# Altium project UltiController.PrjPcb
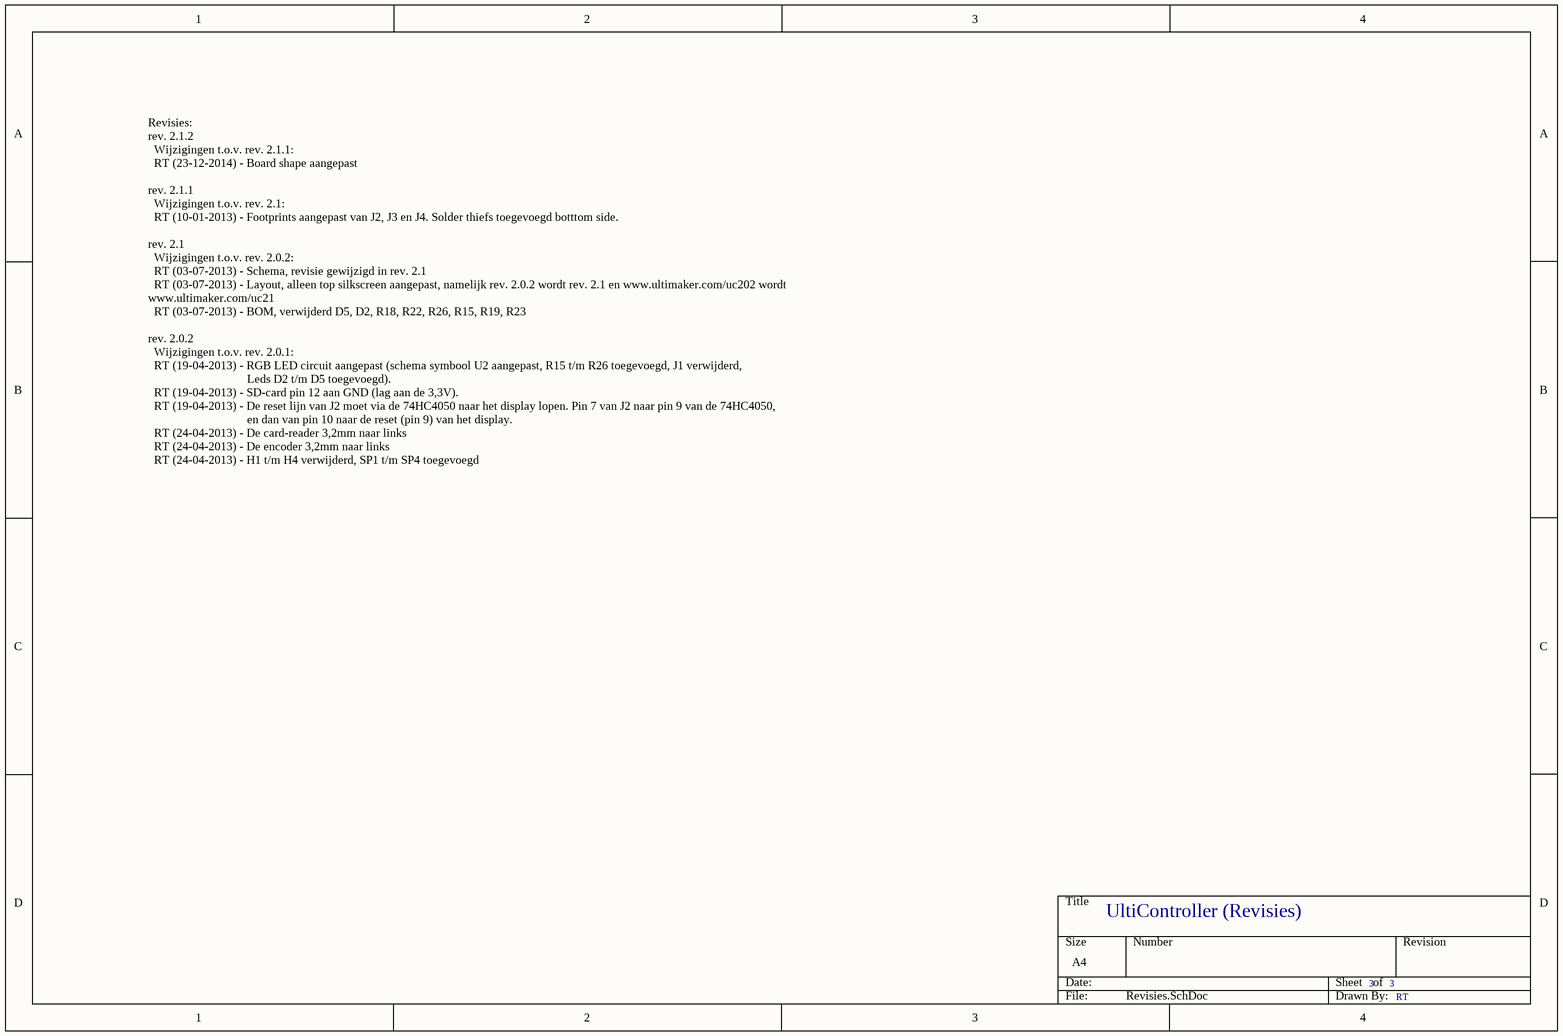
[diagram p0: Revisies.SchDoc]
3 sheets, 131 parts. Net scope: flat (ports and power ports of the same name join across sheets).
Board file: UltiController.PcbDoc
Sheets:
  Revisies.SchDoc
  Sheet1.SchDoc
  Sheet2.SchDoc

## Sheet Revisies.SchDoc
size A4; CompanyName: Ultimaker; Revision: rev. 2.0.2

### Notes on the sheet
- Revisies:
  rev. 2.1.2
  Wijzigingen t.o.v. rev. 2.1.1:
  RT (23-12-2014) - Board shape aangepast
  rev. 2.1.1
  Wijzigingen t.o.v. rev. 2.1:
  RT (10-01-2013) - Footprints aangepast van J2, J3 en J4. Solder thiefs toegevoegd botttom side.
  rev. 2.1
  Wijzigingen t.o.v. rev. 2.0.2:
  RT (03-07-2013) - Schema, revisie gewijzigd in rev. 2.1
  RT (03-07-2013) - Layout, alleen top silkscreen aangepast, namelijk rev. 2.0.2 wordt rev. 2.1 en www.ultimaker.com/uc202 wordt                                      www.ultimaker.com/uc21
  RT (03-07-2013) - BOM, verwijderd D5, D2, R18, R22, R26, R15, R19, R23
  rev. 2.0.2
  Wijzigingen t.o.v. rev. 2.0.1:
  RT (19-04-2013) - RGB LED circuit aangepast (schema symbool U2 aangepast, R15 t/m R26 toegevoegd, J1 verwijderd,
  Leds D2 t/m D5 toegevoegd).
  RT (19-04-2013) - SD-card pin 12 aan GND (lag aan de 3,3V).
  RT (19-04-2013) - De reset lijn van J2 moet via de 74HC4050 naar het display lopen. Pin 7 van J2 naar pin 9 van de 74HC4050,
  en dan van pin 10 naar de reset (pin 9) van het display.
  RT (24-04-2013) - De card-reader 3,2mm naar links
  RT (24-04-2013) - De encoder 3,2mm naar links
  RT (24-04-2013) - H1 t/m H4 verwijderd, SP1 t/m SP4 toegevoegd
- UltiController (Revisies)
- 3
- RT

## Sheet Sheet1.SchDoc
size A4; CompanyName: Ultimaker; Revision: rev. 2.1.2
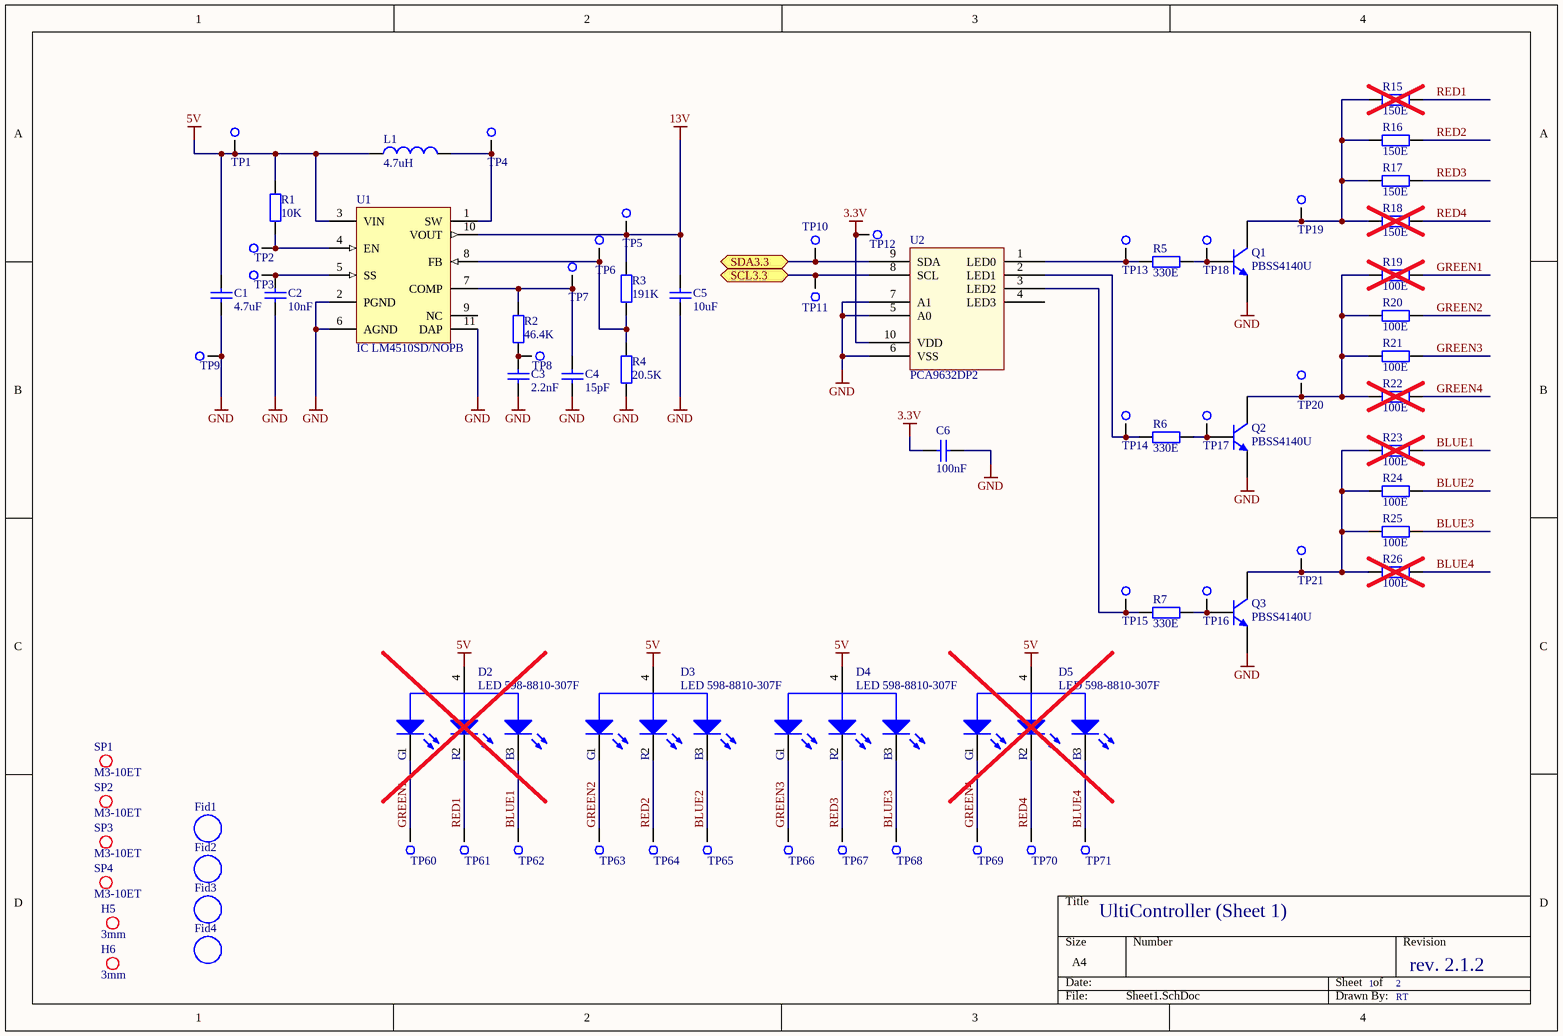
[diagram p1: Sheet1.SchDoc]

### Parts
C1  4.7uF  [C1206 (3216)]
C2  10nF  [C0805 (2012)]
C3  2.2nF  [C0805 (2012)]
C4  15pF  [C0805 (2012)]
C5  10uF  [C1206 (3216)]
C6  100nF  [C0805 (2012)]
D2  LED 598-8810-307F  [LED SMD  598-8810-307F]  (no BOM)
D3  LED 598-8810-307F  [LED SMD  598-8810-307F]
D4  LED 598-8810-307F  [LED SMD  598-8810-307F]
D5  LED 598-8810-307F  [LED SMD  598-8810-307F]  (no BOM)
Fid1  Fiducial  [Fiducial 1,5mm]  (value not drawn)  (no BOM)
Fid2  Fiducial  [Fiducial 1,5mm]  (value not drawn)  (no BOM)
Fid3  Fiducial  [Fiducial 1,5mm]  (value not drawn)  (no BOM)
Fid4  Fiducial  [Fiducial 1,5mm]  (value not drawn)  (no BOM)
H5  3mm  [Mounting Hole 3mm PTH]  (no BOM)
H6  3mm  [Mounting Hole 3mm PTH]  (no BOM)
L1  4.7uH  [Inductor MCSDC0604]
Q1  PBSS4140U  [IC SOT323]
Q2  PBSS4140U  [IC SOT323]
Q3  PBSS4140U  [IC SOT323]
R1  10K  [R0805 (2012)]
R2  46.4K  [R0805 (2012)]
R3  191K  [R0805 (2012)]
R4  20.5K  [R0805 (2012)]
R5  330E  [R0805 (2012)]
R6  330E  [R0805 (2012)]
R7  330E  [R0805 (2012)]
R15  150E  [R0805 (2012)]  (no BOM)
R16  150E  [R0805 (2012)]
R17  150E  [R0805 (2012)]
R18  150E  [R0805 (2012)]  (no BOM)
R19  100E  [R0805 (2012)]  (no BOM)
R20  100E  [R0805 (2012)]
R21  100E  [R0805 (2012)]
R22  100E  [R0805 (2012)]  (no BOM)
R23  100E  [R0805 (2012)]  (no BOM)
R24  100E  [R0805 (2012)]
R25  100E  [R0805 (2012)]
R26  100E  [R0805 (2012)]  (no BOM)
SP1  M3-10ET  [Spacer M3-10ET]
SP2  M3-10ET  [Spacer M3-10ET]
SP3  M3-10ET  [Spacer M3-10ET]
SP4  M3-10ET  [Spacer M3-10ET]
TP1  2mm  [TESTPOINT 2mm]  (value not drawn)  (no BOM)
TP2  2mm  [TESTPOINT 2mm]  (value not drawn)  (no BOM)
TP3  2mm  [TESTPOINT 2mm]  (value not drawn)  (no BOM)
TP4  2mm  [TESTPOINT 2mm]  (value not drawn)  (no BOM)
TP5  2mm  [TESTPOINT 2mm]  (value not drawn)  (no BOM)
TP6  2mm  [TESTPOINT 2mm]  (value not drawn)  (no BOM)
TP7  2mm  [TESTPOINT 2mm]  (value not drawn)  (no BOM)
TP8  2mm  [TESTPOINT 2mm]  (value not drawn)  (no BOM)
TP9  2mm  [TESTPOINT 2mm]  (value not drawn)  (no BOM)
TP10  2mm  [TESTPOINT 2mm]  (value not drawn)  (no BOM)
TP11  2mm  [TESTPOINT 2mm]  (value not drawn)  (no BOM)
TP12  2mm  [TESTPOINT 2mm]  (value not drawn)  (no BOM)
TP13  2mm  [TESTPOINT 2mm]  (value not drawn)  (no BOM)
TP14  2mm  [TESTPOINT 2mm]  (value not drawn)  (no BOM)
TP15  2mm  [TESTPOINT 2mm]  (value not drawn)  (no BOM)
TP16  2mm  [TESTPOINT 2mm]  (value not drawn)  (no BOM)
TP17  2mm  [TESTPOINT 2mm]  (value not drawn)  (no BOM)
TP18  2mm  [TESTPOINT 2mm]  (value not drawn)  (no BOM)
TP19  2mm  [TESTPOINT 2mm]  (value not drawn)  (no BOM)
TP20  2mm  [TESTPOINT 2mm]  (value not drawn)  (no BOM)
TP21  2mm  [TESTPOINT 2mm]  (value not drawn)  (no BOM)
TP60  2mm  [TESTPOINT 2mm]  (value not drawn)  (no BOM)
TP61  2mm  [TESTPOINT 2mm]  (value not drawn)  (no BOM)
TP62  2mm  [TESTPOINT 2mm]  (value not drawn)  (no BOM)
TP63  2mm  [TESTPOINT 2mm]  (value not drawn)  (no BOM)
TP64  2mm  [TESTPOINT 2mm]  (value not drawn)  (no BOM)
TP65  2mm  [TESTPOINT 2mm]  (value not drawn)  (no BOM)
TP66  2mm  [TESTPOINT 2mm]  (value not drawn)  (no BOM)
TP67  2mm  [TESTPOINT 2mm]  (value not drawn)  (no BOM)
TP68  2mm  [TESTPOINT 2mm]  (value not drawn)  (no BOM)
TP69  2mm  [TESTPOINT 2mm]  (value not drawn)  (no BOM)
TP70  2mm  [TESTPOINT 2mm]  (value not drawn)  (no BOM)
TP71  2mm  [TESTPOINT 2mm]  (value not drawn)  (no BOM)
U1  IC LM4510SD/NOPB  [IC SDA10A]
U2  PCA9632DP2  [IC TSSOP-10]

### Ports
SCL3.3 (bidir), SDA3.3 (bidir)

### Nets
3.3V: C6.1 TP12.1 U2.10(VDD)
5V: C1.2 D2.4 D3.4 D4.4 D5.4 L1.1 R1.2 TP1.1 U1.3(VIN)
13V: C5.2 R3.2 TP5.1 U1.10(VOUT)
GND: C1.1 C2.1 C3.1 C4.1 C5.1 C6.2 Q1.2(E) Q2.2(E) Q3.2(E) R4.1 TP9.1 U1.2(PGND) U1.6(AGND) U1.11(DAP) U2.5(A0) U2.6(VSS) U2.7(A1)
BLUE1: D2.3 R23.2 TP62.1
BLUE2: D3.3 R24.2 TP65.1
BLUE3: D4.3 R25.2 TP68.1
BLUE4: D5.3 R26.2 TP71.1
GREEN1: D2.1 R19.2 TP60.1
GREEN2: D3.1 R20.2 TP63.1
GREEN3: D4.1 R21.2 TP66.1
GREEN4: D5.1 R22.2 TP69.1
RED1: D2.2 R15.2 TP61.1
RED2: D3.2 R16.2 TP64.1
RED3: D4.2 R17.2 TP67.1
RED4: D5.2 R18.2 TP70.1
NetC2_2: C2.2 TP3.1 U1.5(SS)
NetC3_2: C3.2 R2.1 TP8.1
NetC4_2: C4.2 R2.2 TP7.1 U1.7(COMP)
NetJ6_13: TP11.1 U2.8(SCL) ; port SCL3.3
NetJ6_14: TP10.1 U2.9(SDA) ; port SDA3.3
NetL1_2: L1.2 TP4.1 U1.1(SW)
NetQ1_1: Q1.1(B) R5.2 TP18.1
NetQ1_3: Q1.3(C) R15.1 R16.1 R17.1 R18.1 TP19.1
NetQ2_1: Q2.1(B) R6.2 TP17.1
NetQ2_3: Q2.3(C) R19.1 R20.1 R21.1 R22.1 TP20.1
NetQ3_1: Q3.1(B) R7.2 TP16.1
NetQ3_3: Q3.3(C) R23.1 R24.1 R25.1 R26.1 TP21.1
NetR1_1: R1.1 TP2.1 U1.4(EN)
NetR3_1: R3.1 R4.2 TP6.1 U1.8(FB)
NetR5_1: R5.1 TP13.1 U2.1(LED0)
NetR6_1: R6.1 TP14.1 U2.2(LED1)
NetR7_1: R7.1 TP15.1 U2.3(LED2)

Not connected (* = marked no-connect by the designer): U1 9(NC); U2 4(LED3)

### Notes on the sheet
- UltiController (Sheet 1)
- 1
- 2
- rev. 2.1.2
- RT
- (in symbol LED 598-8810-307F) G; R; B

### Library data of the parts
C1 = Cap 4.7uF X7R 1206: Cap 4.7uF 1206 X7R 10% 25V; Mfg: TDK; Mfg code: C3216X7R1E475K160AC; Faber ItemCode: -; Max soldering temp: -; Remarks: -; Supplier: Farnell; Supplier code: 1907356; Value: 4.7uF; SMD: Yes
C2 = Cap 10nF X7R 0805: Cap 10nF X7R 0805 10% 100V; Mfg: AVX; Mfg code: 08051C103K4Z2A; Faber ItemCode: -; Max soldering temp: -; Remarks: -; Supplier: Farnell; Supplier code: 1833850; SMD: Yes; Value: 10nF
C3 = Cap 2.2nF X7R 0805: Cap 2.2nF X7R 0805 10% 100V; Mfg: KEMET; Mfg code: C0805F222K1RACAUTO; Faber ItemCode: -; Max soldering temp: -; Remarks: -; Supplier: Farnell; Supplier code: 1869056; Value: 2.2nF; SMD: Yes
C4 = Cap 15pF NPO 0805: Cap 15pF NPO 0805 5% 100V; Mfg: AVX; Mfg code: 08051A150JAT2A; Faber ItemCode: -; Max soldering temp: -; Remarks: -; Supplier: Farnell; Supplier code: 1658873; Value: 15pF; SMD: Yes
C5 = Cap 10uF X7R 1206: Cap 10uF 1206 X7R 10% 25V; Mfg: KEMET; Mfg code: C1206C106K3RAC TU; Faber ItemCode: -; Max soldering temp: -; Remarks: -; Supplier: Farnell; Supplier code: 2118134; Value: 10uF; SMD: Yes
C6 = Cap 100nF X7R 0805: Cap 100nF X7R 0805 10% 100V; Mfg: AVX; Mfg code: 08051C104K4T2A; Faber ItemCode: -; Max soldering temp: -; Remarks: -; Supplier: Farnell; Supplier code: 1833888; Value: 100nF; SMD: Yes
D2-D5 = LED 598-8810-307F: LED MULTICOLOR RED/GRN/BLUE 1208; Mfg: DIALIGHT; Bestel grote: 1; Prijs: 2.26; Mfg code: 598-8810-307F; Faber itemcode: -; Supplier: Farnell; Supplier code: 1850760; Remarks: -; Value: -; Max soldering temp: -; SMD: Yes; Faber Artikelomschrijving: -
Fid1-Fid4 = Fiducial: Remarks: Not a component; Faber ItemCode: -; Mfg: -; Mfg code: -; Value: -; Supplier: -; Supplier code: -; Max soldering temp: -
H5 H6 = Mounting Hole 3mm PTH: Remarks: Not a component; Faber ItemCode: -; Mfg: -; Mfg code: -; Value: -; Supplier: -; Supplier code: -; Max soldering temp: -
L1 = Inductor 4.7uH SMD: Mfg: MULTICOMP; Mfg code: MCSDC0604-4R7MU; Faber ItemCode: -; Max soldering temp: -; Remarks: -; SMD: Yes; Supplier: Farnell; Supplier code: 1864164RL; Value: 4.7uH
Q1-Q3 = NPN PBSS4140U: NPN PBSS4140U SOT-323 1A; Mfg: NXP; Faber ItemCode: -; Max soldering temp: -; Mfg code: PBSS4140U; Remarks: -; Supplier: Farnell; Supplier code: 8736197; Value: -; SMD: Yes
R1 = Res 10K 0805: Res 10K 0805 1% 100mW; Mfg: MULTICOMP; Mfg code: MC 0.1W 0805 1% 10K; Faber ItemCode: -; Max soldering temp: -; Remarks: -; Supplier: Farnell; Supplier code: 9332391; Value: 10K; SMD: Yes
R2 = Res 46.4K 0805: Res 46.4K 0805 1% 100mW; Mfg: MULTICOMP; Mfg code: MC0.1W08051%46K4; Faber ItemCode: -; Max soldering temp: -; Remarks: -; Supplier: Farnell; Supplier code: 2141881RL; Value: 46.4K; SMD: Yes
R3 = Res 191K 0805: Res 191K 0805 1% 125mW; Mfg: VISHAY DRALORIC; Mfg code: CRCW0805191KFKEA; Faber ItemCode: -; Max soldering temp: -; Remarks: -; Supplier: Farnell; Supplier code: 2139049; Value: 191K; SMD: Yes
R4 = Res 20.5K 0805: Res 20.5K 0805 1% 100mW; Mfg: MULTICOMP; Mfg code: MC0.1W08051%20K5; Faber ItemCode: -; Max soldering temp: -; Remarks: -; Supplier: Farnell; Supplier code: 2141862RL; Value: 20.5K; SMD: Yes
R5-R7 = Res 330E 0805: Res 330E 0805 1% 100mW; Mfg: MULTICOMP; Mfg code: MC 0.1W 0805 1% 330R; Faber ItemCode: -; Max soldering temp: -; Remarks: -; Supplier: Farnell; Supplier code: 9333037; Value: 330E; SMD: Yes
R15-R18 = Res 150E 0805: Res 150E 0805 1% 125mW; Faber ItemCode: 31224600; Mfg: YAGEO; Mfg code: 2322 734 61501; Faber Artikelomschrijving: RES 150E 1% 0,125W 0805; Bestel grote: 5000; Prijs: 0,0012; Max soldering temp: -; Remarks: -; Supplier: AVNET Abacus; Supplier code: 2322 734 61501; Value: 150E; SMD: Yes
R19-R26 = Res 100E 0805: Res 100E 0805 1% 125mW; Faber ItemCode: 31560100; Mfg: YAGEO; Mfg code: WRC31022/ RC0805FR-07100RL; Faber Artikelomschrijving: RES 100E 1% 0,125W 0805; Bestel grote: 5000; Prijs: 0,0009; Max soldering temp: -; Remarks: -; Supplier: Rutronik; Supplier code: WRC31022/ RC0805FR-07100RL; Value: 100E; SMD: Yes
SP1-SP4 = Spacer M3-10ET: Spacer SMTSO-M3-10ET; Faber ItemCode: 36462900; Mfg: PEM; Faber Artikelomschrijving: MOER-SMD SMTSO-M3-10ET  PEM; Bestel grote: 300; Prijs: 0.4311; Mfg code: SMTSO-M3-10ET; Value: -; Remarks: -; Supplier: Onkenhout & Onkenhout; Supplier code: SMTSO-M3-10ET; Max soldering temp: -; SMD: Yes
TP1-TP21 TP60-TP71 = Testpoint, 2mm, round: Remarks: Not a component; Faber ItemCode: -; Mfg: -; Mfg code: -; Value: -; Supplier: -; Supplier code: -; Max soldering temp: -
U1 = IC LM4510SD/NOPB: IC Synchronous Step-Up DC/DC Converter with True Shutdown Isolation, 10-pin LLP, Pb-Free; Faber ItemCode: 36966700; Mfg: TEXAS INSTRUMENTS; Faber Artikelomschrijving: IC LM4510SD/NOPB LLP-10 TI; Bestel grote: 1; Prijs: 1,10; Max soldering temp: -; Mfg code: LM4510SD/NOPB; Remarks: -; SMD: Yes; Supplier: Digikey; Supplier code: LM4510SD/NOPBDKR-ND; Value: -
U2 = IC PCA9632: IC LED DRIVER RGBA; Faber ItemCode: 36966800; Mfg: NXP; Faber Artikelomschrijving: IC PCA9632DP2 TSSOP-10 NXP; Bestel grote: 1000; Prijs: 1,0876; Max soldering temp: -; Mfg code: PCA9632DP2; Remarks: -; SMD: Yes; Supplier: Digikey; Supplier code: 568-8254-6-ND; Value: -

## Sheet Sheet2.SchDoc
size A4; CompanyName: Ultimaker; Revision: rev. 2.0.2
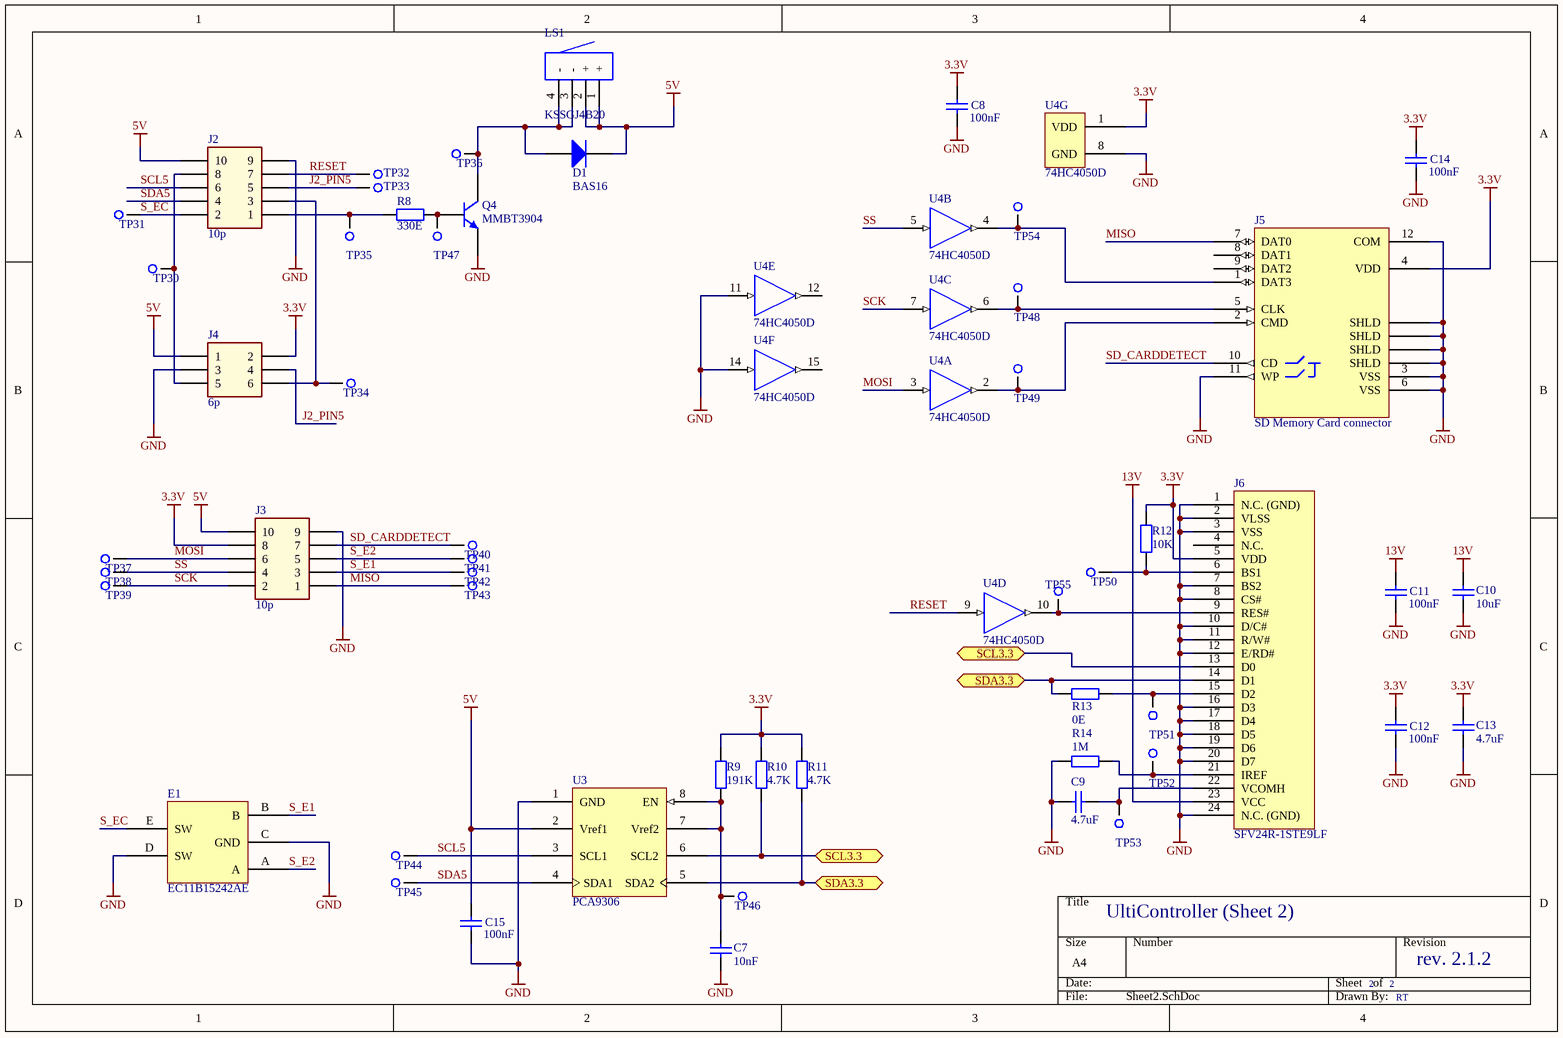
[diagram p2: Sheet2.SchDoc]

### Parts
C7  10nF  [C0805 (2012)]
C8  100nF  [C0805 (2012)]
C9  4.7uF  [C1206 (3216)]
C10  10uF  [C1206 (3216)]
C11  100nF  [C0805 (2012)]
C12  100nF  [C0805 (2012)]
C13  4.7uF  [C1206 (3216)]
C14  100nF  [C0805 (2012)]
C15  100nF  [C0805 (2012)]
D1  BAS16  [IC SOT23]
E1  EC11B15242AE  [Misc EC11B15242AE]
J2  10p  [HEADER 10P right angle]
J3  10p  [HEADER 10P right angle]
J4  6p  [HEADER 6P RIGHT ANGLE]
J5  SD Memory Card connector  [CON SD-Card]
J6  SFV24R-1STE9LF  [Con SFV24R-1STE9LF]
LS1  KSSGJ4B20  [Buzzer KSSGJ4B20]
Q4  MMBT3904  [IC SOT23]
R8  330E  [R0805 (2012)]
R9  191K  [R0805 (2012)]
R10  4.7K  [R0805 (2012)]
R11  4.7K  [R0805 (2012)]
R12  10K  [R0805 (2012)]
R13  0E  [R0805 (2012)]
R14  1M  [R0805 (2012)]
TP30  2mm  [TESTPOINT 2mm]  (value not drawn)  (no BOM)
TP31  2mm  [TESTPOINT 2mm]  (value not drawn)  (no BOM)
TP32  2mm  [TESTPOINT 2mm]  (value not drawn)  (no BOM)
TP33  2mm  [TESTPOINT 2mm]  (value not drawn)  (no BOM)
TP34  2mm  [TESTPOINT 2mm]  (value not drawn)  (no BOM)
TP35  2mm  [TESTPOINT 2mm]  (value not drawn)  (no BOM)
TP36  2mm  [TESTPOINT 2mm]  (value not drawn)  (no BOM)
TP37  2mm  [TESTPOINT 2mm]  (value not drawn)  (no BOM)
TP38  2mm  [TESTPOINT 2mm]  (value not drawn)  (no BOM)
TP39  2mm  [TESTPOINT 2mm]  (value not drawn)  (no BOM)
TP40  2mm  [TESTPOINT 2mm]  (value not drawn)  (no BOM)
TP41  2mm  [TESTPOINT 2mm]  (value not drawn)  (no BOM)
TP42  2mm  [TESTPOINT 2mm]  (value not drawn)  (no BOM)
TP43  2mm  [TESTPOINT 2mm]  (value not drawn)  (no BOM)
TP44  2mm  [TESTPOINT 2mm]  (value not drawn)  (no BOM)
TP45  2mm  [TESTPOINT 2mm]  (value not drawn)  (no BOM)
TP46  2mm  [TESTPOINT 2mm]  (value not drawn)  (no BOM)
TP47  2mm  [TESTPOINT 2mm]  (value not drawn)  (no BOM)
TP48  2mm  [TESTPOINT 2mm]  (value not drawn)  (no BOM)
TP49  2mm  [TESTPOINT 2mm]  (value not drawn)  (no BOM)
TP50  2mm  [TESTPOINT 2mm]  (value not drawn)  (no BOM)
TP51  2mm  [TESTPOINT 2mm]  (value not drawn)  (no BOM)
TP52  2mm  [TESTPOINT 2mm]  (value not drawn)  (no BOM)
TP53  2mm  [TESTPOINT 2mm]  (value not drawn)  (no BOM)
TP54  2mm  [TESTPOINT 2mm]  (value not drawn)  (no BOM)
TP55  2mm  [TESTPOINT 2mm]  (value not drawn)  (no BOM)
U3  PCA9306  [IC SSOP-8]
U4  74HC4050D  [IC SOIC-16]  (parts A,B,C,D,E,F,G of 7)

### Ports
SCL3.3 (bidir), SDA3.3 (bidir)

### Nets
3.3V: C8.2 C12.2 C13.1 C14.2 J3.8 J4.2 J5.4(VDD) J6.5(VDD) R9.2 R10.2 R11.2 R12.2 U4.1(VDD)
5V: C15.2 D1.3(K) J2.10 J3.10 J4.1 LS1.1(+) LS1.2(+) U3.2(Vref1)
13V: C10.2 C11.2 J6.23(VCC)
GND: C7.1 C8.1 C9.2 C10.1 C11.1 C12.1 C13.2 C14.1 C15.1 E1.C(GND) E1.D(SW) J2.9 J3.9 J4.3 J5.3(VSS) J5.6(VSS) J5.11(WP) J5.12(COM) J5.A(SHLD) J5.B(SHLD) J5.C(SHLD) J5.D(SHLD) J6.1(N.C._(GND)) J6.2(VLSS) J6.3(VSS) J6.7(BS2) J6.8(CS#) J6.10(D/C#) J6.11(R/W#) J6.12(E/RD#) J6.16(D3) J6.17(D4) J6.18(D5) J6.19(D6) J6.20(D7) J6.24(N.C._(GND)) Q4.2(E) R14.1 U3.1(GND) U4.8(GND) U4.11(A) U4.14(A)
J2_PIN5: J2.5 J4.4 TP33.1
MISO: J3.1 J5.7(DAT0) TP43.1
MOSI: J3.6 TP37.1 U4.3(A)
RESET: J2.7 TP32.1 U4.9(A)
S_E1: E1.B J3.3 TP42.1
S_E2: E1.A J3.5 TP41.1
S_EC: E1.E(SW) J2.2 TP31.1
SCK: J3.2 TP39.1 U4.7(A)
SCL5: J2.6 TP44.1 U3.3(SCL1)
SD_CARDDETECT: J3.7 J5.10(CD) TP40.1
SDA5: J2.4 TP45.1 U3.4(SDA1)
SS: J3.4 TP38.1 U4.5(A)
NetC7_2: C7.2 R9.1 TP46.1 U3.7(Vref2) U3.8(EN)
NetC9_1: C9.1 J6.22(VCOMH) TP53.1
NetD1_1: D1.1(A) LS1.3(-) LS1.4(-) Q4.3(C) TP36.1
NetJ2_1: J2.1 R8.1 TP35.1
NetJ2_3: J2.3 J4.6 TP34.1
NetJ2_8: J2.8 J4.5 TP30.1
NetJ5_1: J5.1(DAT3) TP54.1 U4.4(Y)
NetJ5_2: J5.2(CMD) TP49.1 U4.2(Y)
NetJ5_5: J5.5(CLK) TP48.1 U4.6(Y)
NetJ6_6: J6.6(BS1) R12.1 TP50.1
NetJ6_9: J6.9(RES#) TP55.1 U4.10(Y)
NetJ6_13: J6.13(D0) R10.1 U3.6(SCL2) ; port SCL3.3
NetJ6_14: J6.14(D1) R11.1 R13.1 U3.5(SDA2) ; port SDA3.3
NetJ6_15: J6.15(D2) R13.2 TP51.1
NetJ6_21: J6.21(IREF) R14.2 TP52.1
NetQ4_1: Q4.1(B) R8.2 TP47.1

Not connected (* = marked no-connect by the designer): J5 8(DAT1) 9(DAT2); J6 4(N.C.); U4 12(Y) 15(Y)

### Notes on the sheet
- UltiController (Sheet 2)
- 2
- rev. 2.1.2
- RT

### Library data of the parts
C7 = Cap 10nF X7R 0805: as C2 on sheet Sheet1; Faber ItemCode: -; Max soldering temp: -; Remarks: -; Supplier: Farnell; Supplier code: 1833850; SMD: Yes; Value: 10nF
C8 C11 C12 C14 C15 = Cap 100nF X7R 0805: as C6 on sheet Sheet1; Faber ItemCode: -; Max soldering temp: -; Remarks: -; Supplier: Farnell; Supplier code: 1833888; Value: 100nF; SMD: Yes
C9 C13 = Cap 4.7uF X7R 1206: as C1 on sheet Sheet1; Faber ItemCode: -; Max soldering temp: -; Remarks: -; Supplier: Farnell; Supplier code: 1907356; Value: 4.7uF; SMD: Yes
C10 = Cap 10uF X7R 1206: as C5 on sheet Sheet1; Faber ItemCode: -; Max soldering temp: -; Remarks: -; Supplier: Farnell; Supplier code: 2118134; Value: 10uF; SMD: Yes
D1 = Diode BAS16: Diode BAS16  SOT23 85V 215MA; Mfg: NXP; Faber ItemCode: -; Max soldering temp: -; Mfg code: BAS16; Remarks: -; SMD: Yes; Supplier: Farnell; Supplier code: 1081180; Value: -
E1 = Misc EC11B15242AE: Misc EC11B15242AE encoder horiz; Mfg: ALPS; Faber ItemCode: -; Max soldering temp: -; Mfg code: EC11B15242AE; Remarks: -; SMD: No; Supplier: Farnell; Supplier code: 2064978; Value: -
J2 J3 = Header 10p: Header 2x5p right angle 2.54mm; Mfg: WURTH ELEKTRONIK; Mfg code: 61201021721; Value: -; Faber ItemCode: -; Max soldering temp: -; Remarks: -; SMD: No; Supplier: Farnell; Supplier code: 1642023
J4 = Header 6p r.a.: Header 2x3p right angle 2.54mm; Mfg: FCI; Mfg code: 68021-206HLF; Value: -; Faber ItemCode: -; Max soldering temp: -; Remarks: -; SMD: No; Supplier: Digikey; Supplier code: 609-3343-ND
J5 = Connector SD-Card-Hirose: Connector Std,reverse SD Memory Card connector; Faber ItemCode: 36966100; Mfg: HRS (HIROSE); Mfg code: DM1AA-SF-PEJ(72); Faber Artikelomschrijving: SD-KAARDHOUDER SMD DM1AA-SF-PEJ(72) HIROSE; Bestel grote: 1; Prijs: 3,02; Value: -; Max soldering temp: -; Remarks: -; SMD: Yes; Supplier: Mouser; Supplier code: 798-DM1AA-SF-PEJ72
J6 = Connector SFV24R-1STE9LF: Connector FPC/FFC 0.5mm R/A 24p SMD; Mfg: FCI; Faber ItemCode: -; Max soldering temp: -; Mfg code: SFV24R-1STE9LF; Remarks: -; SMD: Yes; Supplier: Farnell; Supplier code: 1830598; Value: -
LS1 = Buzzer KSSGJ4B20: Buzzer KSSGJ4B20 SMD; Mfg: KINGSTATE; Faber ItemCode: -; Max soldering temp: -; Mfg code: KSSGJ4B20; Remarks: -; SMD: Yes; Supplier: Farnell; Supplier code: 1502710; Value: -
Q4 = NPN MMBT3904: NPN MMBT3904 SOT-23 200mA; Mfg: NXP; Mfg code: MMBT3904,215; Faber ItemCode: -; Max soldering temp: -; Remarks: -; Supplier: Farnell; Supplier code: 1757935; Value: -; SMD: Yes
R8 = Res 330E 0805: as R5 on sheet Sheet1; Faber ItemCode: -; Max soldering temp: -; Remarks: -; Supplier: Farnell; Supplier code: 9333037; Value: 330E; SMD: Yes
R9 = Res 191K 0805: as R3 on sheet Sheet1; Faber ItemCode: -; Max soldering temp: -; Remarks: -; Supplier: Farnell; Supplier code: 2139049; Value: 191K; SMD: Yes
R10 R11 = Res 4.7K 0805: Res 4.7K 0805 1% 100mW; Mfg: MULTICOMP; Mfg code: MC 0.1W 0805 1% 4K7; Faber ItemCode: -; Max soldering temp: -; Remarks: -; Supplier: Farnell; Supplier code: 9333266; Value: 4.7K; SMD: Yes
R12 = Res 10K 0805: as R1 on sheet Sheet1; Faber ItemCode: -; Max soldering temp: -; Remarks: -; Supplier: Farnell; Supplier code: 9332391; Value: 10K; SMD: Yes
R13 = Res 0E 0805: Res 0E 0805 1% 100mW; Mfg: MULTICOMP; Mfg code: MC 0.1W 0805 0R; Faber ItemCode: -; Max soldering temp: -; Remarks: -; Supplier: Farnell; Supplier code: 9333681; Value: 0E; SMD: Yes
R14 = Res 1M 0805: Res 1M 0805 1% 100mW; Mfg: MULTICOMP; Mfg code: MC 0.1W 0805 1% 1M; Faber ItemCode: -; Max soldering temp: -; Remarks: -; Supplier: Farnell; Supplier code: 9332413; Value: 1M; SMD: Yes
TP30-TP55 = Testpoint, 2mm, round: Remarks: Not a component; Faber ItemCode: -; Mfg: -; Mfg code: -; Value: -; Supplier: -; Supplier code: -; Max soldering temp: -
U3 = IC PCA9306: IC PCA9306 Voltage Level translator; Mfg: TEXAS INSTRUMENTS; Mfg code: PCA9306DCTR; Faber ItemCode: -; Max soldering temp: -; Remarks: -; SMD: Yes; Supplier: Farnell; Supplier code: 1470936; Value: -
U4 = IC 74HC4050D: IC Hex Non-Inverting Buffer/Logic-Level Down Converter; Faber ItemCode: 35592900; Mfg: NXP; Faber Artikelomschrijving: IC 74HC4050D SO-16 NXP; Bestel grote: 2500; Prijs: 0,0878; Max soldering temp: -; Mfg code: 74HC4050D; Remarks: -; SMD: Yes; Supplier: Arrow CE GmbH; Supplier code: 74HC4050D,653 (T&R); Value: -

## Nets that join several sheets
3.3V: Sheet1 (C6.1 TP12.1 U2.10), Sheet2 (13 pins)
5V: Sheet1 (9 pins), Sheet2 (8 pins)
13V: Sheet1 (C5.2 R3.2 TP5.1 U1.10), Sheet2 (C10.2 C11.2 J6.23)
GND: Sheet1 (17 pins), Sheet2 (42 pins)
NetJ6_13: Sheet1 (TP11.1 U2.8), Sheet2 (J6.13 R10.1 U3.6)
NetJ6_14: Sheet1 (TP10.1 U2.9), Sheet2 (J6.14 R11.1 R13.1 U3.5)